# Altium schematic sheet 40.SchDoc
size 513 x 386 mm
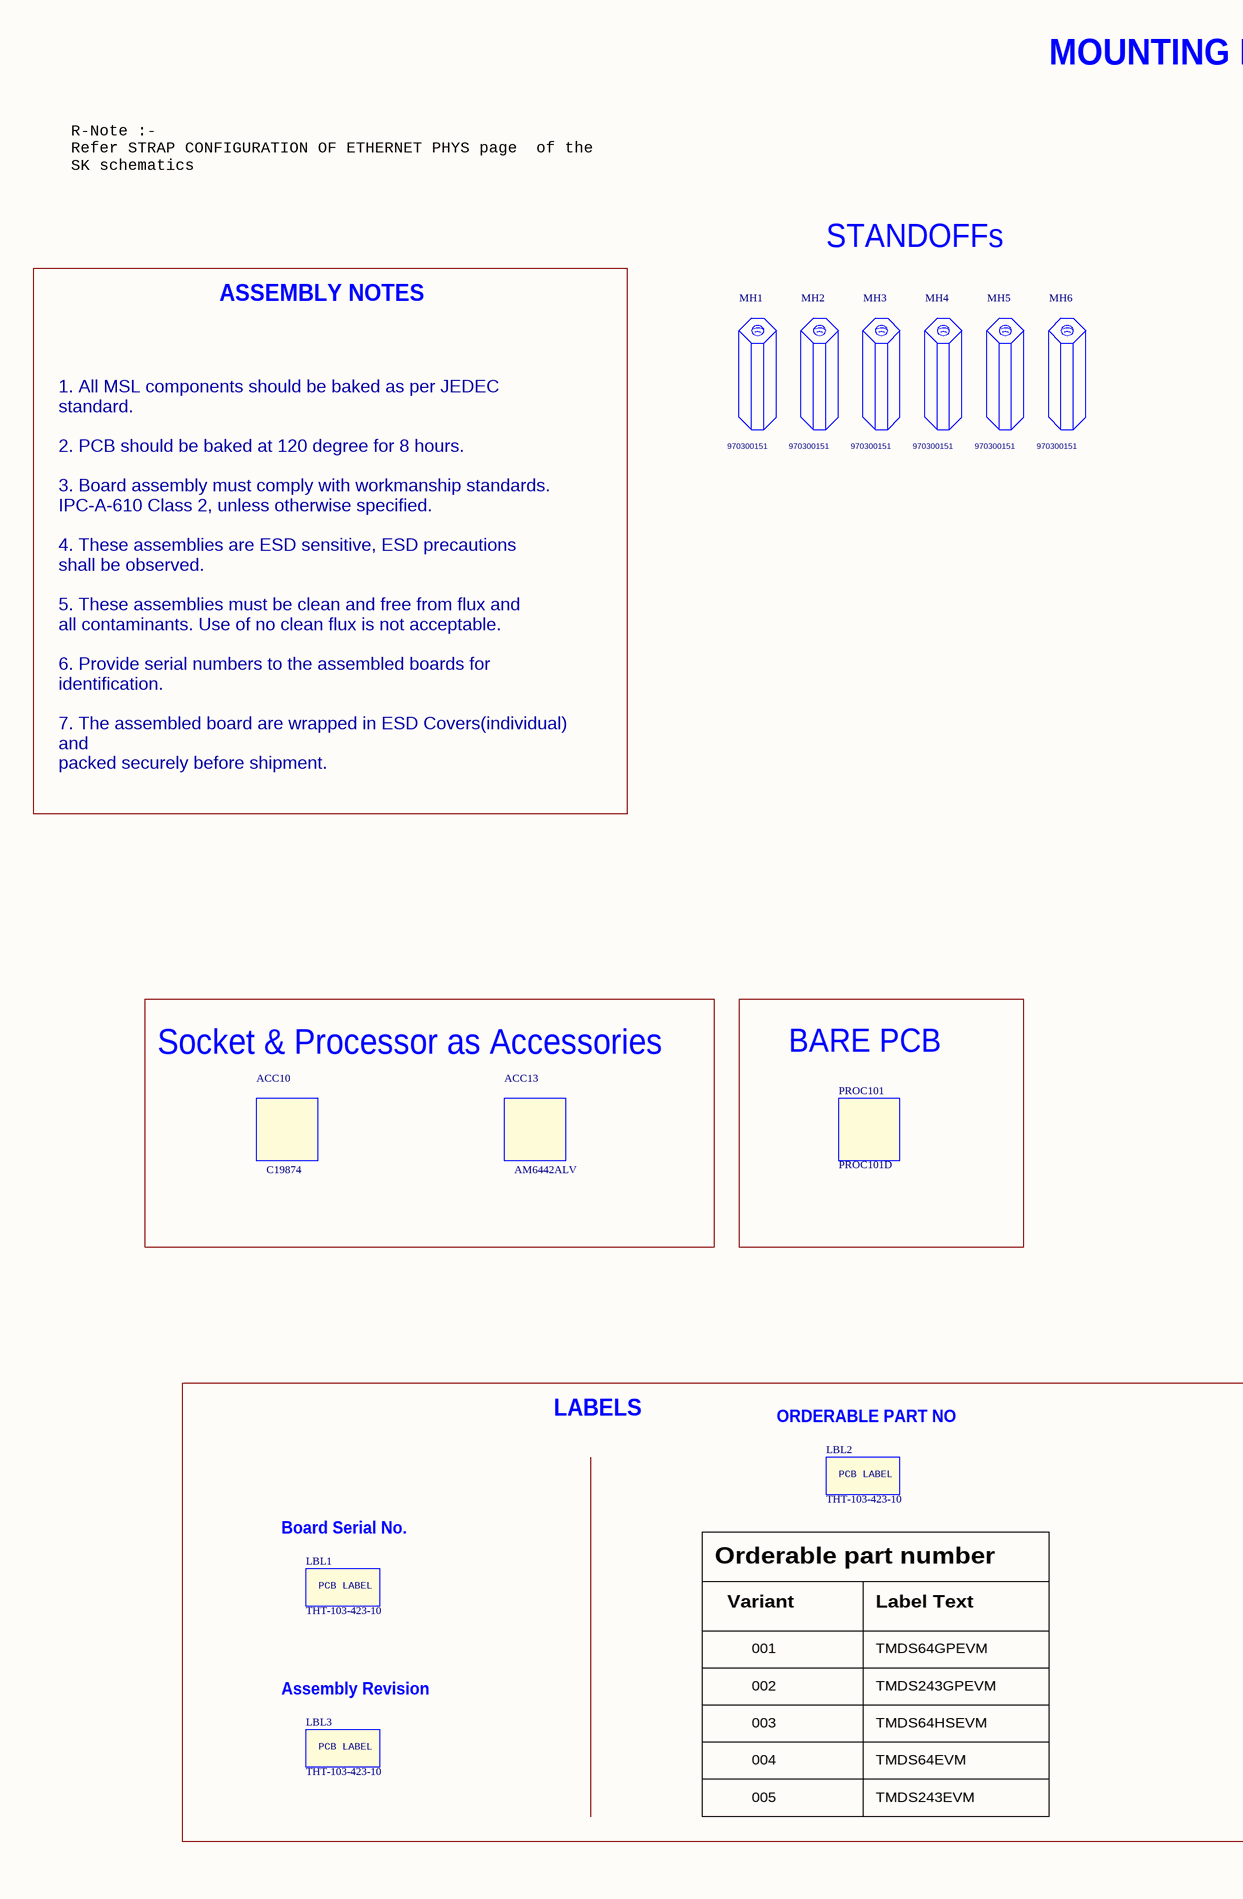
[diagram p0: 40.SchDoc, left]
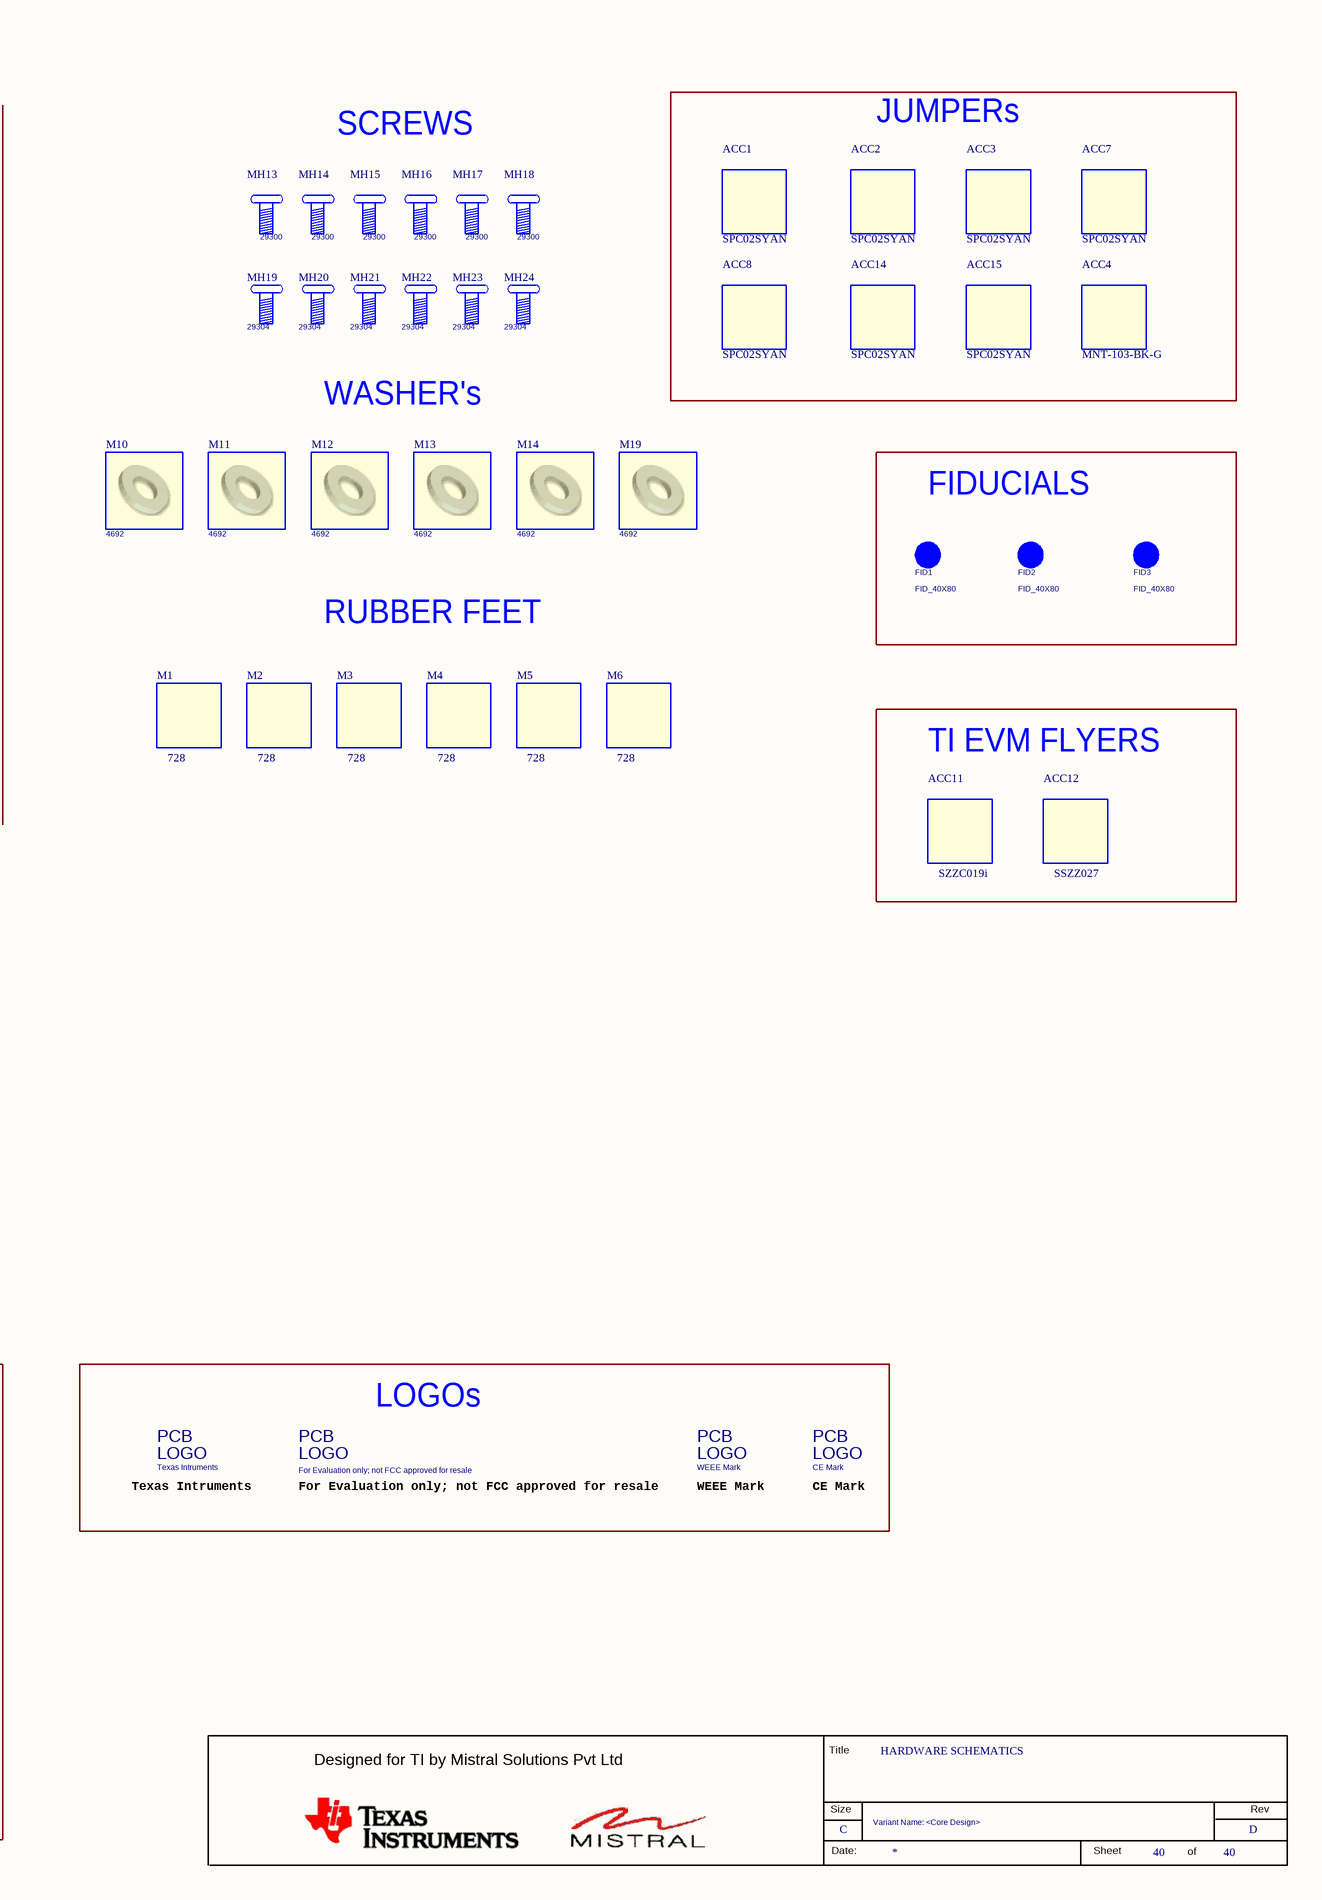
[diagram p1: 40.SchDoc, right]

## Parts
*  RevCode: D  Title: HARDWARE SCHEMATICS  Page Size: C  Page Number: 40  Variant Name: <Core Design>  (hidden comment: MISTRAL_TITLEBLK_CSIZE)  (graphical)
ACC1  SPC02SYAN  [NA]
ACC2  SPC02SYAN  [NA]
ACC3  SPC02SYAN  [NA]
ACC4  MNT-103-BK-G  [NA]
ACC7  SPC02SYAN  [NA]
ACC8  SPC02SYAN  [NA]
ACC10  C19874  [BGASKT441_C19874_1190X1190_11]
ACC11  SZZC019i  [NA]
ACC12  SSZZ027  [NA]
ACC13  AM6442ALV
ACC14  SPC02SYAN  [NA]
ACC15  SPC02SYAN  [NA]
FID1  FID_40X80  [Fiducial10-20]
FID2  FID_40X80  [Fiducial10-20]
FID3  FID_40X80  [Fiducial10-20]
LBL1  THT-103-423-10  [NA]
LBL2  THT-103-423-10  [NA]
LBL3  THT-103-423-10  [NA]
Logo1  Texas Intruments  [TI_Stacked_Overlay_Small]
Logo2  For Evaluation only; not FCC approved for resale  [FCC_disclaimer]
Logo3  WEEE Mark  [TI_Stacked_Overlay_Small]
Logo4  CE Mark  [TI_Stacked_Overlay_Small]
M1  728  [NA]
M2  728  [NA]
M3  728  [NA]
M4  728  [NA]
M5  728  [NA]
M6  728  [NA]
M10  Mfr_part_number: 4692  [NA]  (hidden comment: PLAIN WASHER_M3)
M11  Mfr_part_number: 4692  [NA]  (hidden comment: PLAIN WASHER_M3)
M12  Mfr_part_number: 4692  [NA]  (hidden comment: PLAIN WASHER_M3)
M13  Mfr_part_number: 4692  [NA]  (hidden comment: PLAIN WASHER_M3)
M14  Mfr_part_number: 4692  [NA]  (hidden comment: PLAIN WASHER_M3)
M19  Mfr_part_number: 4692  [NA]  (hidden comment: PLAIN WASHER_M3)
MH1  Mfr_part_number: 970300151  [NA]  (hidden comment: HEX SPACER_M2.5 X 30)
MH2  Mfr_part_number: 970300151  [NA]  (hidden comment: HEX SPACER_M2.5 X 30)
MH3  Mfr_part_number: 970300151  [NA]  (hidden comment: HEX SPACER_M2.5 X 30)
MH4  Mfr_part_number: 970300151  [NA]  (hidden comment: HEX SPACER_M2.5 X 30)
MH5  Mfr_part_number: 970300151  [NA]  (hidden comment: HEX SPACER_M2.5 X 30)
MH6  Mfr_part_number: 970300151  [NA]  (hidden comment: HEX SPACER_M2.5 X 30)
MH13  Mfr_part_number: 29300  [NA]  (hidden comment: PAN HEAD_M2.5 X 4)
MH14  Mfr_part_number: 29300  [NA]  (hidden comment: PAN HEAD_M2.5 X 4)
MH15  Mfr_part_number: 29300  [NA]  (hidden comment: PAN HEAD_M2.5 X 4)
MH16  Mfr_part_number: 29300  [NA]  (hidden comment: PAN HEAD_M2.5 X 4)
MH17  Mfr_part_number: 29300  [NA]  (hidden comment: PAN HEAD_M2.5 X 4)
MH18  Mfr_part_number: 29300  [NA]  (hidden comment: PAN HEAD_M2.5 X 4)
MH19  Mfr_part_number: 29304  [NA]  (hidden comment: PAN HEAD_M2.5 X 12)
MH20  Mfr_part_number: 29304  [NA]  (hidden comment: PAN HEAD_M2.5 X 12)
MH21  Mfr_part_number: 29304  [NA]  (hidden comment: PAN HEAD_M2.5 X 12)
MH22  Mfr_part_number: 29304  [NA]  (hidden comment: PAN HEAD_M2.5 X 12)
MH23  Mfr_part_number: 29304  [NA]  (hidden comment: PAN HEAD_M2.5 X 12)
MH24  Mfr_part_number: 29304  [NA]  (hidden comment: PAN HEAD_M2.5 X 12)
PCB1  PROC101  Mfr_part_number: PROC101D

## Blocks framed on the sheet
JUMPERs: ACC1-ACC4 ACC7 ACC8 ACC14 ACC15
FIDUCIALS: FID1-FID3
TI EVM FLYERS: ACC11 ACC12
Socket & Processor as Accessories: ACC10 ACC13
BARE PCB: PCB1
LABELS: LBL1-LBL3
LOGOs: Logo1-Logo4

## Notes on the sheet
- MOUNTING HARDWARE
- R-Note :-
  Refer STRAP CONFIGURATION OF ETHERNET PHYS page  of the
  SK schematics
- SCREWS
- STANDOFFs
- 1. All MSL components should be baked as per JEDEC
  standard.
  2. PCB should be baked at 120 degree for 8 hours.
  3. Board assembly must comply with workmanship standards.
  IPC-A-610 Class 2, unless otherwise specified.
  4. These assemblies are ESD sensitive, ESD precautions
  shall be observed.
  5. These assemblies must be clean and free from flux and
  all contaminants. Use of no clean flux is not acceptable.
  6. Provide serial numbers to the assembled boards for
  identification.
  7. The assembled board are wrapped in ESD Covers(individual)
  and
  packed securely before shipment.
- ASSEMBLY NOTES
- WASHER's
- RUBBER FEET
- (near LBL2) ORDERABLE PART NO
- Texas Intruments
- For Evaluation only; not FCC approved for resale
- WEEE Mark
- CE Mark
- (near LBL1) Board Serial No.
- Orderable part number
- Variant
- 001
- Label Text
- TMDS64GPEVM
- (near LBL3) Assembly Revision
- 002
- TMDS243GPEVM
- 003
- 004
- TMDS64HSEVM
- TMDS64EVM
- 005
- TMDS243EVM
- (in symbol ACCESSORY_THT-3-423-10) PCB LABEL
- (in symbol FCC_disclaimer) PCB; LOGO
- (in symbol MISTRAL_TITLEBLK_CSIZE) Title; Designed for TI by Mistral Solutions Pvt Ltd; Size; Rev; Date:; Sheet; of
- (in symbol TI_Logo) PCB; LOGO
- (in symbol TI_Logo_Dup1) PCB; LOGO

## Library data of the parts
* = MISTRAL_TITLEBLK_CSIZE: Issue: 1.0; Page Create Date: March  8, 1995; Page Count: 40; Page Modify Date: *
ACC1 ACC3 ACC7 ACC14 ACC15 = ACCESSORY_Dup1: ACCESSORIE JUMPER SHORTING GOLD FLASH; Mistral Part No: 160009030153-R; Mfr_name: SULLINS CONNECTOR; Part_type: ACCESSORIES; Project: SMART VIEW_NVR; PCB Footprint: NA; Footprint Path: Y:\MIS_DATABASE\Library\ALTIUM_TOOL\PCB_FOOTPRINTS\Altium_Footprint_Lib.PcbLib; Library Path: Y:\MIS_DATABASE\Library\ALTIUM_TOOL\SCHEMATICS_PARTS\MS_MECHANICAL_Library.schlib; MECHANICAL 3D STEP FILE: NA; Temperature: -55癈+105癈; Weight: NA; Wattage: NA; Voltage: NA; Tolerance: NA; Mfr_part_number: SPC02SYAN; Package: NA; Distributor_name: DIGIKEY; Distributor_part_number: S9001-ND; Library Ref: ACCESSORY; Height: NA; Datasheet: Y:\MIS_DATABASE\DATASHEETS\MISC\MODULES\SPC02SYAN.PDF; Crtd /date: USMAN/301208; Chkd/date: SUHAS\211010
ACC2 ACC8 = ACCESSORY_Dup1: ACCESSORIE JUMPER SHORTING GOLD FLASH; Part_type: ACCESSORIES; Mfr_name: SULLINS CONNECTOR; Mistral Part No: 160009030153-R; Project: SMART VIEW_NVR; PCB Footprint: NA; Footprint Path: Y:\MIS_DATABASE\Library\ALTIUM_TOOL\PCB_FOOTPRINTS\Altium_Footprint_Lib.PcbLib; Library Path: Y:\MIS_DATABASE\Library\ALTIUM_TOOL\SCHEMATICS_PARTS\MS_MECHANICAL_Library.schlib; MECHANICAL 3D STEP FILE: NA; Temperature: -55癈+105癈; Weight: NA; Wattage: NA; Voltage: NA; Tolerance: NA; Chkd/date: SUHAS\211010; Crtd /date: USMAN/301208; Datasheet: Y:\MIS_DATABASE\DATASHEETS\MISC\MODULES\SPC02SYAN.PDF; Height: NA; Library Ref: ACCESSORY; Distributor_part_number: S9001-ND; Distributor_name: DIGIKEY; Package: NA; Mfr_part_number: SPC02SYAN
ACC4 = ACCESSORY_Dup1: ACCESSORIE CONNECTOR SHUNT 2X3 POS EDGE MOUNT SOCKET STRIP; Part_type: ACCESSORIES; Mfr_name: SAMTEC; Mistral Part No: 160017110050-R; Project: TI_MAXIE_CPB; PCB Footprint: NA; MECHANICAL 3D STEP FILE: NA; Chkd/date: MANIRAJA/141117; Crtd /date: MANIRAJA/141117; Datasheet: Y:\MIS_DATABASE\DATASHEETS\MISC\ACCESSORIES\SAMTEC-MNT-SER.PDF; Temperature: -55癈+125癈; Weight: NA; Height: NA; Distributor_part_number: SAM10620-ND; Distributor_name: DIGIKEY; Package: NA; Wattage: NA; Voltage: NA; Tolerance: NA; Mfr_part_number: MNT-103-BK-G; Library Ref: ACCESSORY
ACC10 = ACCESSORY: ACCESSORIE BGA SOCKET AM64x MICROPROCESSOR BGA441; Part_type: ACCESSORIES; Mfr_name: IRONWOOD ELECTRONICS; Mistral Part No: 160020060058; Custom_Duty: NA; Project: AM64x-GP_EVM BRD; PCB Footprint: BGASKT441_C19874_1190X1190_11; Footprint Path: NA; Library Path: NA; MECHANICAL 3D STEP FILE: BGASKT441_C19874_1190X1190_11; Customs_HS_Code: NA; RoHS: NA; Chkd/date: MANIRAJA/220620; Crtd /date: ALVY/220620; Datasheet: Y:\MIS_DATABASE\DATASHEETS\MISC\ACCESSORIES\C19874_MAY20.PDF; Temperature: -55癈+160癈; Weight: 39530mg; Height: 10.93MM; Library Ref: ACCESSORY; Distributor_part_number: NA; Distributor_name: NA; Package: BGA441; Wattage: NA; Voltage: NA; Tolerance: NA; Mfr_part_number: C19874; Footprint Ref: BGASKT441_C19874_1190X1190_11
ACC11 = ACCESSORY_Dup1: ACCESSORIE TI EVM FLYERS STANDARD TERMS AND CONDITIONS; Part_type: ACCESSORIES; Mfr_name: TEXAS INSTRUMENTS; Mistral Part No: 160020100056; Project: AM64x-IO LINK BRD; Footprint Path: NA; Library Path: NA; MECHANICAL 3D STEP FILE: NA; Custom_Duty: NA; Customs_HS_Code: NA; RoHS: NA; Chkd/date: MANIRAJA/221020; Crtd /date: ALVY/211020; Datasheet: NA; Temperature: NA; Weight: NA; Height: NA; Library Ref: ACCESSORY; Distributor_part_number: NA; Distributor_name: NA; Package: NA; Wattage: NA; Voltage: NA; Tolerance: NA; Mfr_part_number: SZZC019i; Footprint Ref: NA; PCB Footprint: NA
ACC12 = ACCESSORY_Dup1: ACCESSORIE TI EVM FLYERS STANDARD WARRANTY NOTICE-BLACK AND WHITE; Part_type: ACCESSORIES; Mfr_name: TEXAS INSTRUMENTS; Mistral Part No: 160020100057; Project: AM64x-IO LINK BRD; Footprint Path: NA; Library Path: NA; MECHANICAL 3D STEP FILE: NA; Custom_Duty: NA; Customs_HS_Code: NA; RoHS: NA; Chkd/date: MANIRAJA/221020; Crtd /date: ALVY/211020; Datasheet: NA; Temperature: NA; Weight: NA; Height: NA; Library Ref: ACCESSORY; Distributor_part_number: NA; Distributor_name: NA; Package: NA; Wattage: NA; Voltage: NA; Tolerance: NA; Mfr_part_number: SSZZ027; Footprint Ref: NA; PCB Footprint: NA
ACC13 = ACCESSORY: IC AM64 SoC MICROPROCESSOR BGA441; Mistral Part No: 141220040002; Mfr_name: TEXAS INSTRUMENTS; Mfr_part_number: AM6442ASFGGAALV; Part_type: ACCESSORIES; Project: AM64x-GP_EVM BRD; Tolerance: NA; Voltage: NA; Wattage: NA; Package: BGA441; Distributor_name: NA; Distributor_part_number: NA; Library Ref: ACCESSORY; Height: 2.57MM; Weight: 39530mg; Temperature: -55癈+160癈; Datasheet: Y:\MIS_DATABASE\DATASHEETS\MISC\ACCESSORIES\C19874_MAY20.PDF; RoHS: NA; Customs_HS_Code: NA; Custom_Duty: NA; Library Path: NA; Footprint Path: NA
FID1-FID3 = Fiducial: PCB Footprint: FID_40X80
LBL1 LBL3 = ACCESSORY_THT-3-423-10: ACCESSORIE 1 WORKHORSE POLYSTER LABLE 0.25" X 1"; Mistral Part No: 160018020185; Mfr_name: BRADY; Part_type: ACCESSORIES; Project: TI_MAXIE_CPB; PCB Footprint: NA; Mfr_part_number: THT-103-423-10; Tolerance: NA; Voltage: NA; Wattage: NA; Package: NA; Distributor_name: NA; Distributor_part_number: NA; Library Ref: ACCESSORY_THT-3-423-10; Footprint Ref: NA; Height: NA; Weight: NA; Temperature: NA; Datasheet: NA; Crtd /date: ALVY/260218; Chkd/date: MANIRAJA/270218; MECHANICAL 3D STEP FILE: NA; Library Path: Y:\MIS_DATABASE\Library\ALTIUM_TOOL\SCHEMATICS_PARTS\MS_MECHANICAL_Library.schlib; Footprint Path: Y:\MIS_DATABASE\Library\ALTIUM_TOOL\PCB_FOOTPRINTS\Altium_Footprint_Lib.PcbLib
LBL2 = ACCESSORY_THT-3-423-10: ACCESSORIE 1 WORKHORSE POLYSTER LABLE 0.25" X 1"; Part_type: ACCESSORIES; Mfr_name: BRADY; Mistral Part No: 160018020185; Project: TI_MAXIE_CPB; PCB Footprint: NA; Footprint Path: Y:\MIS_DATABASE\Library\ALTIUM_TOOL\PCB_FOOTPRINTS\Altium_Footprint_Lib.PcbLib; Library Path: Y:\MIS_DATABASE\Library\ALTIUM_TOOL\SCHEMATICS_PARTS\MS_MECHANICAL_Library.schlib; MECHANICAL 3D STEP FILE: NA; Chkd/date: MANIRAJA/270218; Crtd /date: ALVY/260218; Datasheet: NA; Temperature: NA; Weight: NA; Height: NA; Footprint Ref: NA; Library Ref: ACCESSORY_THT-3-423-10; Distributor_part_number: NA; Distributor_name: NA; Package: NA; Wattage: NA; Voltage: NA; Tolerance: NA; Mfr_part_number: THT-103-423-10
Logo1 Logo3 = TI_Logo_Dup1
Logo2 = FCC_disclaimer: PCB Footprint: FCC_disclaimer
Logo4 = TI_Logo: PCB Footprint: TI_Stacked_Overlay_Small
M1 M4 = ACCESSORY_Dup1: ACCESSORIE RECESSED BUMPER 19.05MM DIA; Part_type: ACCESSORIES; Mfr_name: KEYSTONE; Mistral Part No: 160018070042-R; Project: TI_MAXIE_CPB; Footprint Path: NA; Library Path: NA; MECHANICAL 3D STEP FILE: NA; Custom_Duty: NA; Customs_HS_Code: NA; Chkd/date: MANIRAJA/110718; Crtd /date: MANIRAJA/110718; Datasheet: Y:\MIS_DATABASE\DATASHEETS\MISC\ACCESSORIES\728.PDF; Temperature: NA; Weight: 2042mg; Height: NA; Library Ref: ACCESSORY; Distributor_part_number: 36-728-ND; Distributor_name: DIGIKEY; Package: NA; Wattage: NA; Voltage: NA; Tolerance: NA; Mfr_part_number: 728; Footprint Ref: NA; PCB Footprint: NA
M2 M3 M5 M6 = ACCESSORY_Dup1: ACCESSORIE RECESSED BUMPER 19.05MM DIA; Mistral Part No: 160018070042-R; Mfr_name: KEYSTONE; Part_type: ACCESSORIES; Project: TI_MAXIE_CPB; Footprint Ref: NA; Mfr_part_number: 728; Tolerance: NA; Voltage: NA; Wattage: NA; Package: NA; Distributor_name: DIGIKEY; Distributor_part_number: 36-728-ND; Library Ref: ACCESSORY; Height: NA; Weight: 2042mg; Temperature: NA; Datasheet: Y:\MIS_DATABASE\DATASHEETS\MISC\ACCESSORIES\728.PDF; Crtd /date: MANIRAJA/110718; Chkd/date: MANIRAJA/110718; Customs_HS_Code: NA; Custom_Duty: NA; MECHANICAL 3D STEP FILE: NA; Library Path: NA; Footprint Path: NA; PCB Footprint: NA
M10 M11 M13 = WASHER_PLAIN: PLAIN WASHER FOR M3 SS-316; Part_type: MECHANICAL\WASHERS; Mfr_name: KEYSTONE; Mistral Part No: 160018020078-R; Project: TI_MAXIE_CPB; Footprint Path: Y:\MIS_DATABASE\Library\ALTIUM_TOOL\PCB_FOOTPRINTS\Altium_Footprint_Lib.PcbLib; Library Path: Y:\MIS_DATABASE\Library\ALTIUM_TOOL\SCHEMATICS_PARTS\MS_MECHANICAL_Library.schlib; MECHANICAL 3D STEP FILE: NA; Chkd/date: MANIRAJA/190218; Crtd /date: MANIRAJA/190218; Datasheet: Y:\MIS_DATABASE\DATASHEETS\MISC\MECHANICAL\4692.PDF; Temperature: NA; Weight: NA; Height: NA; Footprint Ref: NA; Library Ref: WASHER_PLAIN; Distributor_part_number: 36-4692-ND; Distributor_name: DIGIKEY; Package: SS; Wattage: NA; Voltage: NA; Tolerance: NA; PCB Footprint: NA
M12 M14 M19 = WASHER_PLAIN: PLAIN WASHER FOR M3 SS-316; Mistral Part No: 160018020078-R; Mfr_name: KEYSTONE; Part_type: MECHANICAL\WASHERS; Project: TI_MAXIE_CPB; Tolerance: NA; Voltage: NA; Wattage: NA; Package: SS; Distributor_name: DIGIKEY; Distributor_part_number: 36-4692-ND; Library Ref: WASHER_PLAIN; Footprint Ref: NA; Height: NA; Weight: NA; Temperature: NA; Datasheet: Y:\MIS_DATABASE\DATASHEETS\MISC\MECHANICAL\4692.PDF; Crtd /date: MANIRAJA/190218; Chkd/date: MANIRAJA/190218; MECHANICAL 3D STEP FILE: NA; Library Path: Y:\MIS_DATABASE\Library\ALTIUM_TOOL\SCHEMATICS_PARTS\MS_MECHANICAL_Library.schlib; Footprint Path: Y:\MIS_DATABASE\Library\ALTIUM_TOOL\PCB_FOOTPRINTS\Altium_Footprint_Lib.PcbLib; PCB Footprint: NA
MH1 = HEX_SPACER_FF: HEX SPACER FEMALE TO FEMALE M2.5 X 30MM; Mistral Part No: 160018020071-R; Mfr_name: WURTH ELECTRONICS; Part_type: MECHANICAL\SPACER; Project: TI_MAXIE_CPB; Tolerance: NA; Voltage: NA; Wattage: NA; Package: SS; Distributor_name: DIGIKEY; Distributor_part_number: 732-10626-ND; Library Ref: HEX_SPACER_FF; Footprint Ref: NA; Height: 30.00MM; Weight: NA; Temperature: NA; Datasheet: Y:\MIS_DATABASE\DATASHEETS\MISC\MECHANICAL\970XXX1.PDF; Crtd /date: MANIRAJA/190218; Chkd/date: MANIRAJA/190218; MECHANICAL 3D STEP FILE: NA; Library Path: Y:\MIS_DATABASE\Library\ALTIUM_TOOL\SCHEMATICS_PARTS\MS_MECHANICAL_Library.schlib; Footprint Path: Y:\MIS_DATABASE\Library\ALTIUM_TOOL\PCB_FOOTPRINTS\Altium_Footprint_Lib.PcbLib; PCB Footprint: NA
MH2-MH6 = HEX_SPACER_FF: HEX SPACER FEMALE TO FEMALE M2.5 X 30MM; Part_type: MECHANICAL\SPACER; Mfr_name: WURTH ELECTRONICS; Mistral Part No: 160018020071-R; Project: TI_MAXIE_CPB; Footprint Path: Y:\MIS_DATABASE\Library\ALTIUM_TOOL\PCB_FOOTPRINTS\Altium_Footprint_Lib.PcbLib; Library Path: Y:\MIS_DATABASE\Library\ALTIUM_TOOL\SCHEMATICS_PARTS\MS_MECHANICAL_Library.schlib; MECHANICAL 3D STEP FILE: NA; Chkd/date: MANIRAJA/190218; Crtd /date: MANIRAJA/190218; Datasheet: Y:\MIS_DATABASE\DATASHEETS\MISC\MECHANICAL\970XXX1.PDF; Temperature: NA; Weight: NA; Height: 30.00MM; Footprint Ref: NA; Library Ref: HEX_SPACER_FF; Distributor_part_number: 732-10626-ND; Distributor_name: DIGIKEY; Package: SS; Wattage: NA; Voltage: NA; Tolerance: NA; PCB Footprint: NA
MH13 MH14 MH18 = SCREW_PAN: PHILLIPS PAN HEAD SCREW - M2.5 X 4 SS-316; Mistral Part No: 160018020076-R; Mfr_name: KEYSTONE; Part_type: MECHANICAL\SCREWS; Project: TI_MAXIE_CPB; Tolerance: NA; Voltage: NA; Wattage: NA; Package: SS; Distributor_name: DIGIKEY; Distributor_part_number: 36-29300-ND; Library Ref: SCREW_PAN; Footprint Ref: NA; Height: 4.00MM; Weight: NA; Temperature: NA; Datasheet: Y:\MIS_DATABASE\DATASHEETS\MISC\MECHANICAL\29300.PDF; Crtd /date: MANIRAJA/190218; Chkd/date: MANIRAJA/190218; MECHANICAL 3D STEP FILE: NA; Library Path: Y:\MIS_DATABASE\Library\ALTIUM_TOOL\SCHEMATICS_PARTS\MS_MECHANICAL_Library.schlib; Footprint Path: Y:\MIS_DATABASE\Library\ALTIUM_TOOL\PCB_FOOTPRINTS\Altium_Footprint_Lib.PcbLib; PCB Footprint: NA
MH15-MH17 = SCREW_PAN: PHILLIPS PAN HEAD SCREW - M2.5 X 4 SS-316; Part_type: MECHANICAL\SCREWS; Mfr_name: KEYSTONE; Mistral Part No: 160018020076-R; Project: TI_MAXIE_CPB; Footprint Path: Y:\MIS_DATABASE\Library\ALTIUM_TOOL\PCB_FOOTPRINTS\Altium_Footprint_Lib.PcbLib; Library Path: Y:\MIS_DATABASE\Library\ALTIUM_TOOL\SCHEMATICS_PARTS\MS_MECHANICAL_Library.schlib; MECHANICAL 3D STEP FILE: NA; Chkd/date: MANIRAJA/190218; Crtd /date: MANIRAJA/190218; Datasheet: Y:\MIS_DATABASE\DATASHEETS\MISC\MECHANICAL\29300.PDF; Temperature: NA; Weight: NA; Height: 4.00MM; Footprint Ref: NA; Library Ref: SCREW_PAN; Distributor_part_number: 36-29300-ND; Distributor_name: DIGIKEY; Package: SS; Wattage: NA; Voltage: NA; Tolerance: NA; PCB Footprint: NA
MH19 MH21 MH23 = SCREW_PAN: PHILLIPS PAN HEAD SCREW - M2.5 X 12; Mistral Part No: 160018070043-R; Mfr_name: KEYSTONE; Part_type: ACCESSORIES; Project: TI_MAXIE_CPB; Footprint Ref: NA; Tolerance: NA; Voltage: NA; Wattage: NA; Package: NA; Distributor_name: DIGIKEY; Distributor_part_number: 36-29304-ND; Library Ref: SCREW_PAN; Height: 12.00MM; Weight: NA; Temperature: NA; Datasheet: Y:\MIS_DATABASE\DATASHEETS\MISC\MECHANICAL\29304.PDF; Crtd /date: MANIRAJA/110718; Chkd/date: MANIRAJA/110718; Customs_HS_Code: NA; Custom_Duty: NA; MECHANICAL 3D STEP FILE: NA; Library Path: NA; Footprint Path: NA; PCB Footprint: NA
MH20 MH22 MH24 = SCREW_PAN: PHILLIPS PAN HEAD SCREW - M2.5 X 12; Part_type: ACCESSORIES; Mfr_name: KEYSTONE; Mistral Part No: 160018070043-R; Project: TI_MAXIE_CPB; Footprint Path: NA; Library Path: NA; MECHANICAL 3D STEP FILE: NA; Custom_Duty: NA; Customs_HS_Code: NA; Chkd/date: MANIRAJA/110718; Crtd /date: MANIRAJA/110718; Datasheet: Y:\MIS_DATABASE\DATASHEETS\MISC\MECHANICAL\29304.PDF; Temperature: NA; Weight: NA; Height: 12.00MM; Library Ref: SCREW_PAN; Distributor_part_number: 36-29304-ND; Distributor_name: DIGIKEY; Package: NA; Wattage: NA; Voltage: NA; Tolerance: NA; Footprint Ref: NA; PCB Footprint: NA
PCB1 = PCB: AM64x EVM Bare PCB; Part_type: ACCESSORIES; Mistral Part No: FY201506000101